# Altium schematic sheet 000_MCU - ESP32.SchDoc: MCU-ESP32
size A3; SheetNumber: 2; SheetTotal: 7
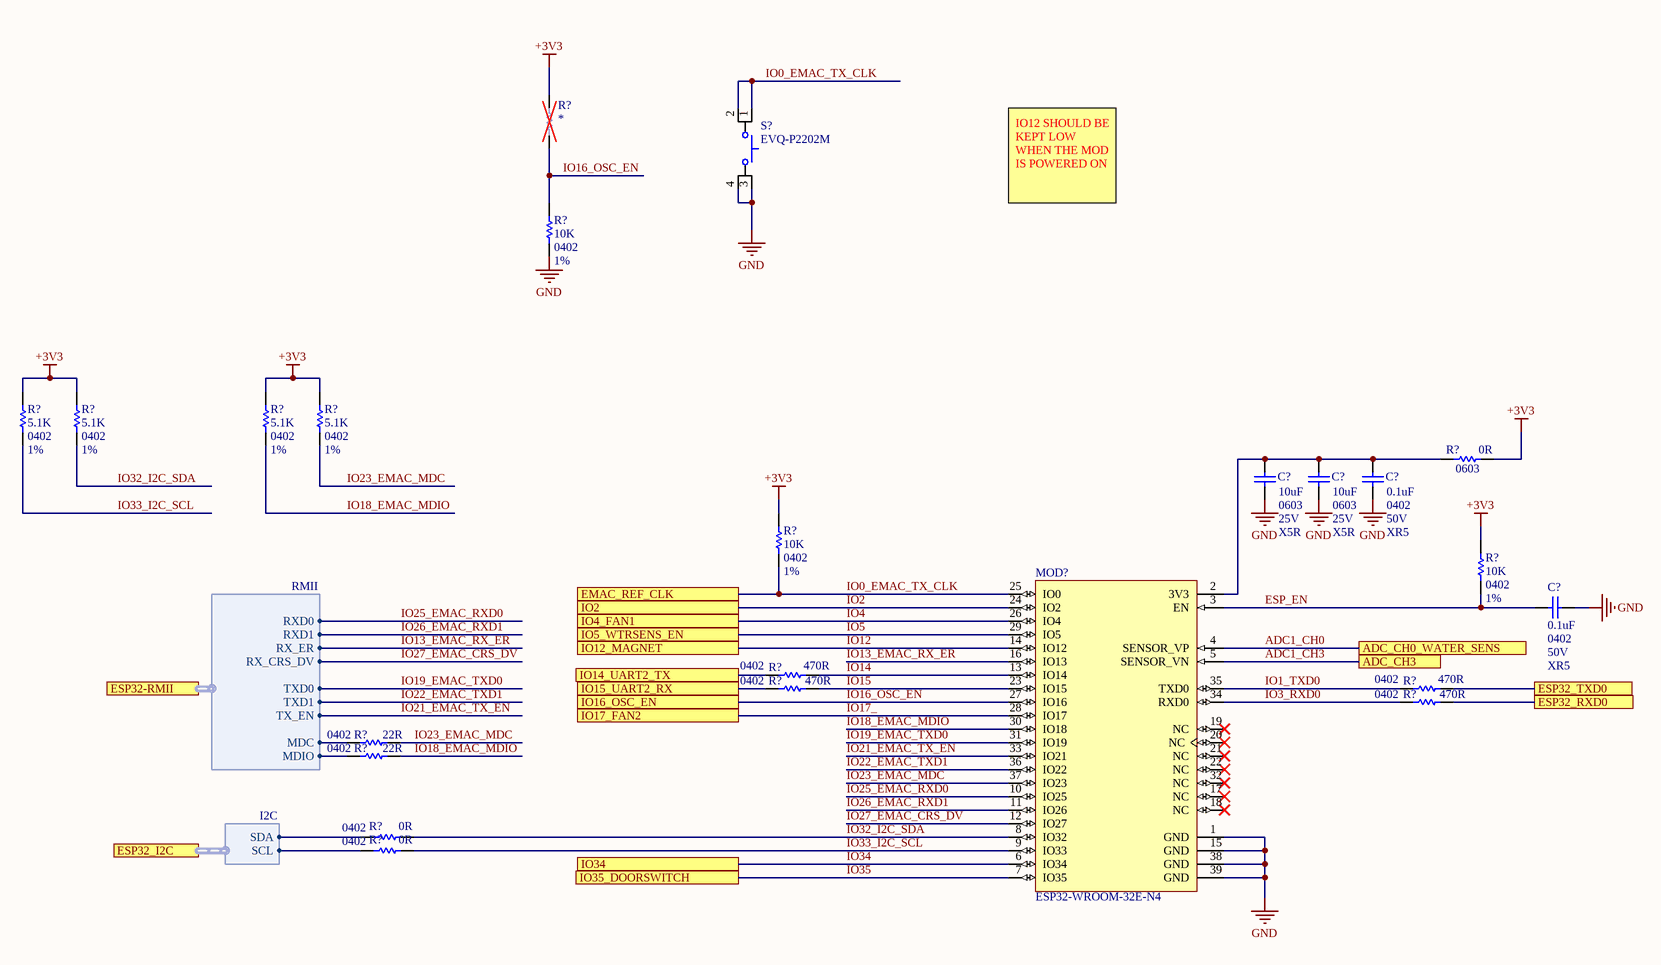
[diagram p0: 000_MCU - ESP32.SchDoc]

## Parts
(Parts that share a designator on the sheet are numbered #1, #2 ... from top to bottom, then left to right.)
C?#1  10uF  PackageReference: 0603  Voltage: 25V  Temperature Coeficient: X5R  [CAPC1608X05N[0603]]
C?#2  10uF  PackageReference: 0603  Voltage: 25V  Temperature Coeficient: X5R  [CAPC1608X05N[0603]]
C?#3  0.1uF  PackageReference: 0402  Voltage: 50V  Temperature Coeficient: XR5  [CAPC1005X03N[0402]]
C?#4  0.1uF  PackageReference: 0402  Voltage: 50V  Temperature Coeficient: XR5  [CAPC1005X03N[0402]]
MOD?  ESP32-WROOM-32E-N4  [ESP32-WROOM-32D]
R?#1  *  [RESC1005X03N[0402]]
R?#2  10K  PackageReference: 0402  Tolerance: 1%  [RESC1005X03N[0402]]
R?#3  5.1K  PackageReference: 0402  Tolerance: 1%  [RESC1005X03N[0402]]
R?#4  5.1K  PackageReference: 0402  Tolerance: 1%  [RESC1005X03N[0402]]
R?#5  5.1K  PackageReference: 0402  Tolerance: 1%  [RESC1005X03N[0402]]
R?#6  5.1K  PackageReference: 0402  Tolerance: 1%  [RESC1005X03N[0402]]
R?#7  0R  PackageReference: 0603  [RESC1608X05N[0603]]
R?#8  10K  PackageReference: 0402  Tolerance: 1%  [RESC1005X03N[0402]]
R?#9  10K  PackageReference: 0402  Tolerance: 1%  [RESC1005X03N[0402]]
R?#10  470R  PackageReference: 0402  [RESC1005X03N[0402]]
R?#11  470R  PackageReference: 0402  [RESC1005X03N[0402]]
R?#12  470R  PackageReference: 0402  [RESC1005X03N[0402]]
R?#13  470R  PackageReference: 0402  [RESC1005X03N[0402]]
R?#14  22R  PackageReference: 0402  [RESC1005X03N[0402]]
R?#15  22R  PackageReference: 0402  [RESC1005X03N[0402]]
R?#16  0R  PackageReference: 0402  [RESC1005X03N[0402]]
R?#17  0R  PackageReference: 0402  [RESC1005X03N[0402]]
S?  EVQ-P2202M  [BTN470X350X210-4N]

## Ports
ADC_CH0_WATER_SENS, ADC_CH3, EMAC_REF_CLK, ESP32-RMII (harness RMII), ESP32_I2C (harness I2C), ESP32_RXD0, ESP32_TXD0, IO2, IO4_FAN1, IO5_WTRSENS_EN, IO12_MAGNET, IO14_UART2_TX, IO15_UART2_RX, IO16_OSC_EN, IO17_FAN2, IO34, IO35_DOORSWITCH

## Harnesses
RMII: TXD0, TXD1, TX_EN, MDC, MDIO, RXD0, RXD1, RX_ER, RX_CRS_DV
I2C: SDA, SCL

## Nets
+3V3: R?#1.2 R?#3.1 R?#4.1 R?#5.1 R?#6.1 R?#7.2 R?#8.2 R?#9.2
GND: C?#1.1 C?#2.1 C?#3.1 C?#4.2 MOD?.1(GND) MOD?.15(GND) MOD?.38(GND) MOD?.39(GND) R?#2.1 S?.3 S?.4
ADC1_CH0: MOD?.4(SENSOR_VP) ; port ADC_CH0_WATER_SENS
ADC1_CH3: MOD?.5(SENSOR_VN) ; port ADC_CH3
ESP32_RXD0: R?#13.1 ; port ESP32_RXD0
ESP32_TXD0: R?#12.1 ; port ESP32_TXD0
ESP_EN: C?#4.1 MOD?.3(EN) R?#9.1
IO0_EMAC_TX_CLK: MOD?.25(IO0) R?#8.1 S?.1 S?.2 ; port EMAC_REF_CLK
IO1_TXD0: MOD?.35(TXD0) R?#12.2
IO2: MOD?.24(IO2) ; port IO2
IO3_RXD0: MOD?.34(RXD0) R?#13.2
IO4: MOD?.26(IO4) ; port IO4_FAN1
IO5: MOD?.29(IO5) ; port IO5_WTRSENS_EN
IO12: MOD?.14(IO12) ; port IO12_MAGNET
IO13_EMAC_RX_ER: MOD?.16(IO13) ; port ESP32-RMII.RX_ER
IO14: MOD?.13(IO14) R?#10.1
IO14_UART2_TX: R?#10.2 ; port IO14_UART2_TX
IO15: MOD?.23(IO15) R?#11.1
IO15_UART2_RX: R?#11.2 ; port IO15_UART2_RX
IO16_OSC_EN: MOD?.27(IO16) R?#1.1 R?#2.2 ; port IO16_OSC_EN
IO17_: MOD?.28(IO17) ; port IO17_FAN2
IO18_EMAC_MDIO: MOD?.30(IO18) R?#5.2 R?#15.2
IO19_EMAC_TXD0: MOD?.31(IO19) ; port ESP32-RMII.TXD0
IO21_EMAC_TX_EN: MOD?.33(IO21) ; port ESP32-RMII.TX_EN
IO22_EMAC_TXD1: MOD?.36(IO22) ; port ESP32-RMII.TXD1
IO23_EMAC_MDC: MOD?.37(IO23) R?#6.2 R?#14.2
IO25_EMAC_RXD0: MOD?.10(IO25) ; port ESP32-RMII.RXD0
IO26_EMAC_RXD1: MOD?.11(IO26) ; port ESP32-RMII.RXD1
IO27_EMAC_CRS_DV: MOD?.12(IO27) ; port ESP32-RMII.RX_CRS_DV
IO32_I2C_SDA: MOD?.8(IO32) R?#4.2 R?#16.1
IO33_I2C_SCL: MOD?.9(IO33) R?#3.2 R?#17.1
IO34: MOD?.6(IO34) ; port IO34
IO35: MOD?.7(IO35) ; port IO35_DOORSWITCH
NetC?#1_2: C?#1.2 C?#2.2 C?#3.2 MOD?.2(3V3) R?#7.1
NetR?#14_1: R?#14.1 ; port ESP32-RMII.MDC
NetR?#15_1: R?#15.1 ; port ESP32-RMII.MDIO
NetR?#16_2: R?#16.2 ; port ESP32_I2C.SDA
NetR?#17_2: R?#17.2 ; port ESP32_I2C.SCL

Not connected (* = marked no-connect by the designer): MOD? 17(NC)* 18(NC)* 19(NC)* 20(NC)* 21(NC)* 22(NC)* 32(NC)*

## Notes on the sheet
- IO12 SHOULD BE KEPT LOW WHEN THE MOD IS POWERED ON
- Title:
- Project:
- File:
- Revision:
- Date:
- Size:
- A3
- Drawn by:
- www.somosinternet.com <http://www.somosinternet.com>

## Library data of the parts
C?#1-C?#4 = CAP-generic: Chip Ceramic Capacitor SMD; Populated: Yes; Manuf1: *; Manuf2: *; Manuf1Partnumber: *; Manuf2Partnumber: *; ClassName: *; ROHS: Yes; LifeCycle: Checked; HelpURL: *
  C?#1 C?#2: Value: 10uF; Supplier 1: DigiKey; Supplier Part Number 1: 1276-1869-1-ND
  C?#3 C?#4: Value: 0.1uF; LCSC: C2888326; ComponentLink1Description: LCSC Link; ComponentLink1URL: https://www.lcsc.com/product-detail/C2888326.html?s_z=n_q_t_0.1uF%25200402&spm=wm.fly.bg.1.xh___wm.ssy.tc.0.tz&lcsc_vid=EgJfAwZfQFAKX11URFdeUQJWEVdaBVZUTgRWV10EQ1MxVlNeRFBaUFRXTlVaVDsOAxUeFF5JWBYZEEoKFBINSQcJGk4NBhADEA4cHktXRlVcSQwSGg0%3D
MOD? = ESP32-WROOM-32E-N4: RF TXRX MOD BT WIFI TH SMD; Manufacturer: Espressif Systems; Manufacturer Part Number: ESP32-WROOM-32E-N4; ComponentLink1URL: https://www.lcsc.com/product-detail/C701341.html?s_z=n_q_%2509%2520ESP32-WROOM-32E; ComponentLink1Description: LCSC; Supplier Part Number: C701341; Supplier: LCSC
R?#1 = DNP-RES: (DNP) "Do Not Populate" Chip Resistor SMD; Populated: No; Value: *; Manuf1: *; Manuf2: *; Manuf1Partnumber: *; Manuf2Partnumber: *; ClassName: *; ROHS: Yes; LifeCycle: Checked; HelpURL: *; Power: *; Tolerance: *
R?#2-R?#9 R?#14 R?#15 = RES-generic: Chip Resistor SMD; Populated: Yes; Manuf1: *; Manuf2: *; Manuf1Partnumber: *; Manuf2Partnumber: *; ClassName: *; ROHS: Yes; LifeCycle: Checked; HelpURL: *; Power: *
  R?#2 R?#8 R?#9: Value: 10K; Supplier 1: DigiKey; Supplier Part Number 1: 311-0.0JRCT-ND; ComponentLink1Description: LCSC Link; ComponentLink1URL: https://www.lcsc.com/product-detail/C2906861.html?s_z=n_q_t_10k%25200402&spm=wm.fly.bg.1.xh___wm.ssy.tc.0.tz&lcsc_vid=E1leBAAAQVAIUVNVR1hWXgVSR1lYV11SQQNbUFxTQQcxVlNeRFVZUVRUQ1NfVTsOAxUeFF5JWBYZEEoKFBINSQcJGk4NBhADEA4cHktXRlVeSQwSGg0%3D; LCSC: C2906861
  R?#3-R?#6: Value: 5.1K; Supplier 1: DigiKey; Supplier Part Number 1: 311-5.10KLRCT-ND
  R?#7: Value: 0R; Tolerance: *; Supplier 1: Digi-Key; Supplier Part Number 1: RMCF0603ZT0R00CT-ND
  R?#14 R?#15: Value: 22R; Tolerance: *; Supplier 1: Digi-Key; Supplier Part Number 1: 311-22.0LRCT-ND
R?#10-R?#13 R?#16 R?#17 = RES-generic: Chip Resistor SMD; Populated: Yes; Tolerance: 1%; Manuf1: *; Manuf2: *; Manuf1Partnumber: *; Manuf2Partnumber: *; ClassName: *; ROHS: Yes; LifeCycle: Checked; HelpURL: *; Power: *; Supplier 1: DigiKey
  R?#10-R?#13: Value: 470R; Supplier Part Number 1: 13-RC0402FR-13470RLCT-ND
  R?#16 R?#17: Value: 0R; Supplier Part Number 1: 311-0.0JRCT-ND
S? = BTN-4N: SPST- NO Momentary Button, 160g Force; Part Number: BTN00002; Manufacturer: Panasonic; Manufacturer Part Number: EVQ-P2202M; Supplier 1: Digi-Key; Supplier Part Number 1: P12298SCT-ND; Supplier Price 1: 0.45619; ComponentLink1URL: http://industrial.panasonic.com/www-data/pdf/ATK0000/ATK0000CE6.pdf; Value: EVQ-P2202M